# Altium schematic sheet CAN.SchDoc
size A4
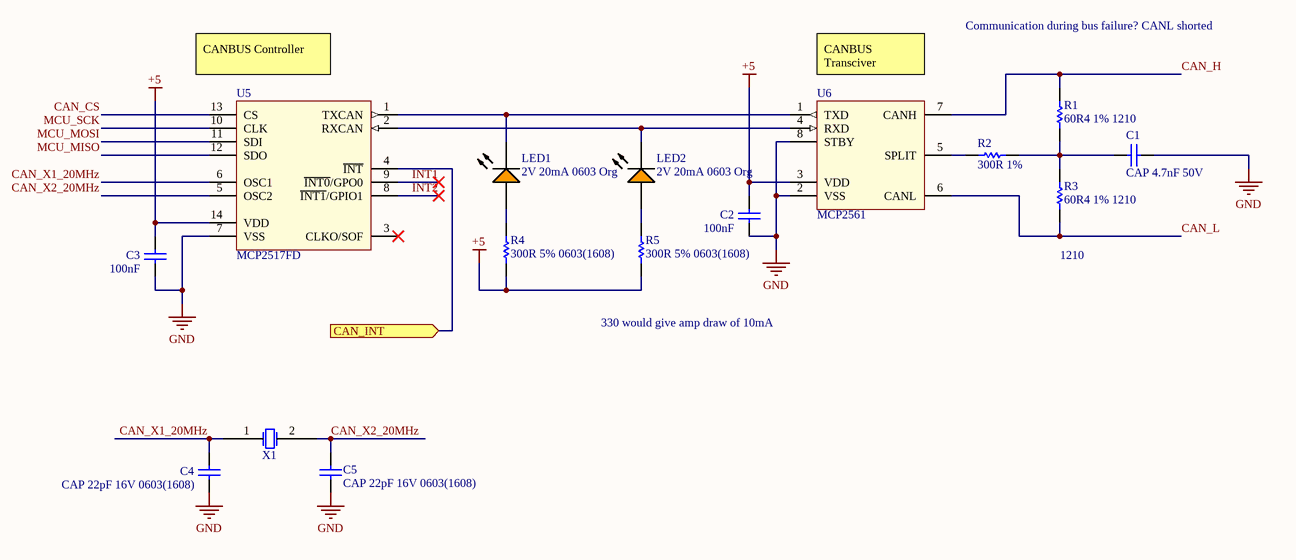
[diagram p0: CAN.SchDoc]

## Parts
C1  CAP 4.7nF 50V  [CAPC0603(1608)100_L]
C2  100nF  [CAPC0603(1608)100_M]
C3  100nF  [CAPC0603(1608)100_M]
C4  CAP 22pF 16V 0603(1608)  [CAPC0603(1608)100_N]
C5  CAP 22pF 16V 0603(1608)  [CAPC0603(1608)100_N]
LED1  2V 20mA 0603 Org  [KING-LED0603-25-ORANGE_V]
LED2  2V 20mA 0603 Org  [KING-LED0603-25-ORANGE_V]
R1  60R4 1% 1210  [RESC1210(3225)_L]
R2  300R 1%  [RESC0603(1608)_M]
R3  60R4 1% 1210  [RESC1210(3225)_L]
R4  300R 5% 0603(1608)  [RESC0603(1608)_N]
R5  300R 5% 0603(1608)  [RESC0603(1608)_N]
U5  MCP2517FD  [MCP2517FD SOIC]
U6  MCP2561  [MCP2561 SOIC]
X1  Crystal 20MHz  [Crystal 20MHz]  (value not drawn)

## Ports
CAN_INT (in)

## Nets
+5: C2.2 C3.2 R4.1 R5.1 U5.14(VDD) U6.3(VDD)
GND: C1.2 C2.1 C3.1 C4.1 C5.2 U5.7(VSS) U6.2(VSS) U6.8(STBY)
CAN_CS: U5.13(CS)
CAN_H: R1.2 U6.7(CANH)
CAN_INT: U5.4(~{INT}) ; port CAN_INT
CAN_L: R3.1 U6.6(CANL)
CAN_X1_20MHz: C4.2 U5.6(OSC1) X1.1
CAN_X2_20MHz: C5.1 U5.5(OSC2) X1.2
INT1: U5.9(~{INT0}/GPO0)
INT2: U5.8(~{INT1}/GPIO1)
MCU_MISO: U5.12(SDO)
MCU_MOSI: U5.11(SDI)
MCU_SCK: U5.10(CLK)
NetC1_1: C1.1 R1.1 R2.2 R3.2
NetLED1_1: LED1.1(A) R4.2
NetLED1_2: LED1.2(K) U5.1(TXCAN) U6.1(TXD)
NetLED2_1: LED2.1(A) R5.2
NetLED2_2: LED2.2(K) U5.2(RXCAN) U6.4(RXD)
NetR2_1: R2.1 U6.5(SPLIT)

Not connected (* = marked no-connect by the designer): U5 3(CLKO/SOF)*

## Notes on the sheet
- (near U5) CANBUS Controller
- (near U6) CANBUS Transciver
- Communication during bus failure? CANL shorted
- (near R3) 1210
- 330 would give amp draw of 10mA
- Title
- Size:
- Date:
- A4
- Number:
- Time:
- Revision:
- Sheet
- of
- File:

## Library data of the parts
C1 = CMP-1035-02200-1: CAP 4.7nF 50V ±1% 0603 (1608 Metric) Thickness 1mm SMD; Tolerance: Â±1%; Case-Metric: 1608; Case-EIA: 0603; Max Thickness: 1 mm; Value: 4.7nF; Technology: SMT; Rated Voltage: 50 V
C2 C3 = CMP-1035-02583-1: CAP 100nF 16V ±5% 0603 (1608 Metric) Thickness 1mm SMD; Tolerance: Â±5%; Case-Metric: 1608; Case-EIA: 0603; Rated Voltage: 16 V; Max Thickness: 1 mm; Technology: SMT; Value: 100nF
C4 C5 = CMP-1035-00808-1: CAP 22pF 16V ±5% 0603 (1608 Metric) Thickness 1mm SMD; Tolerance: Â±5%; Case-EIA: 0603; Case-Metric: 1608; Technology: SMT; Value: 22pF; Rated Voltage: 16 V; Max Thickness: 1 mm
LED1 LED2 = CMP-0239-00002-1: LED, SMT, 0603(1608), 0.25mm Tthickness, Super Bright Orange; PartNumber: APG1608SEKC/T; Forward Current: 30 mA; Power Dissipation: 75 mW; Reverse Voltage: 5 V; Packing: Reel; PackageDescription: 2-Pin SMT LED, 1.6 x 0.8 mm Body, 0.25mm Thickness; ComponentLink1URL: http://www.kingbrightusa.com/; PackageVersion: Rev. 4A, 12/2011; Storage Temperature: -40 to 85 degC; Mounting Technology: Surface Mount; ComponentLink2Description: Datasheet; DatasheetVersion: Rev. 4A, 12/2011; ComponentLink2URL: http://www.kingbrightusa.com/images/catalog/SPEC/APG1608SEKC-T.pdf; PackageReference: LED0603-25-ORANGE; ComponentLink1Description: Manufacturer URL
R1 R3 = CMP-1015-00372-1: 60R4 0.5W 1% 1210 (3225 Metric)  SMD; Case-Metric: 3225; Case-EIA: 1210; Value: 60.40 Ohm; Technology: SMT; Tolerance: 1 %; Power: 0.5 W
R2 = CMP-1012-00449-1: 300R 0.1W 1% 0603 (1608 Metric)  SMD; Value: 300.00 Ohm; Case-EIA: 0603; Case-Metric: 1608; Technology: SMT; Power: 0.1 W; Tolerance: 1 %
R4 R5 = CMP-1012-00061-1: 300R 0.1W 5% 0603 (1608 Metric)  SMD; Case-EIA: 0603; Value: 300.00 Ohm; Case-Metric: 1608; Tolerance: 5 %; Power: 0.1 W; Technology: SMT
X1 = Crystal 20MHz: ComponentLink1Description: Datasheet; ComponentLink1URL: http://cfd.citizen.co.jp/english/prod-tech/product/pdf/datasheet_AT/HCM49_E.pdf